# Altium project PCB_Project_Batteries_V2.PrjPCB
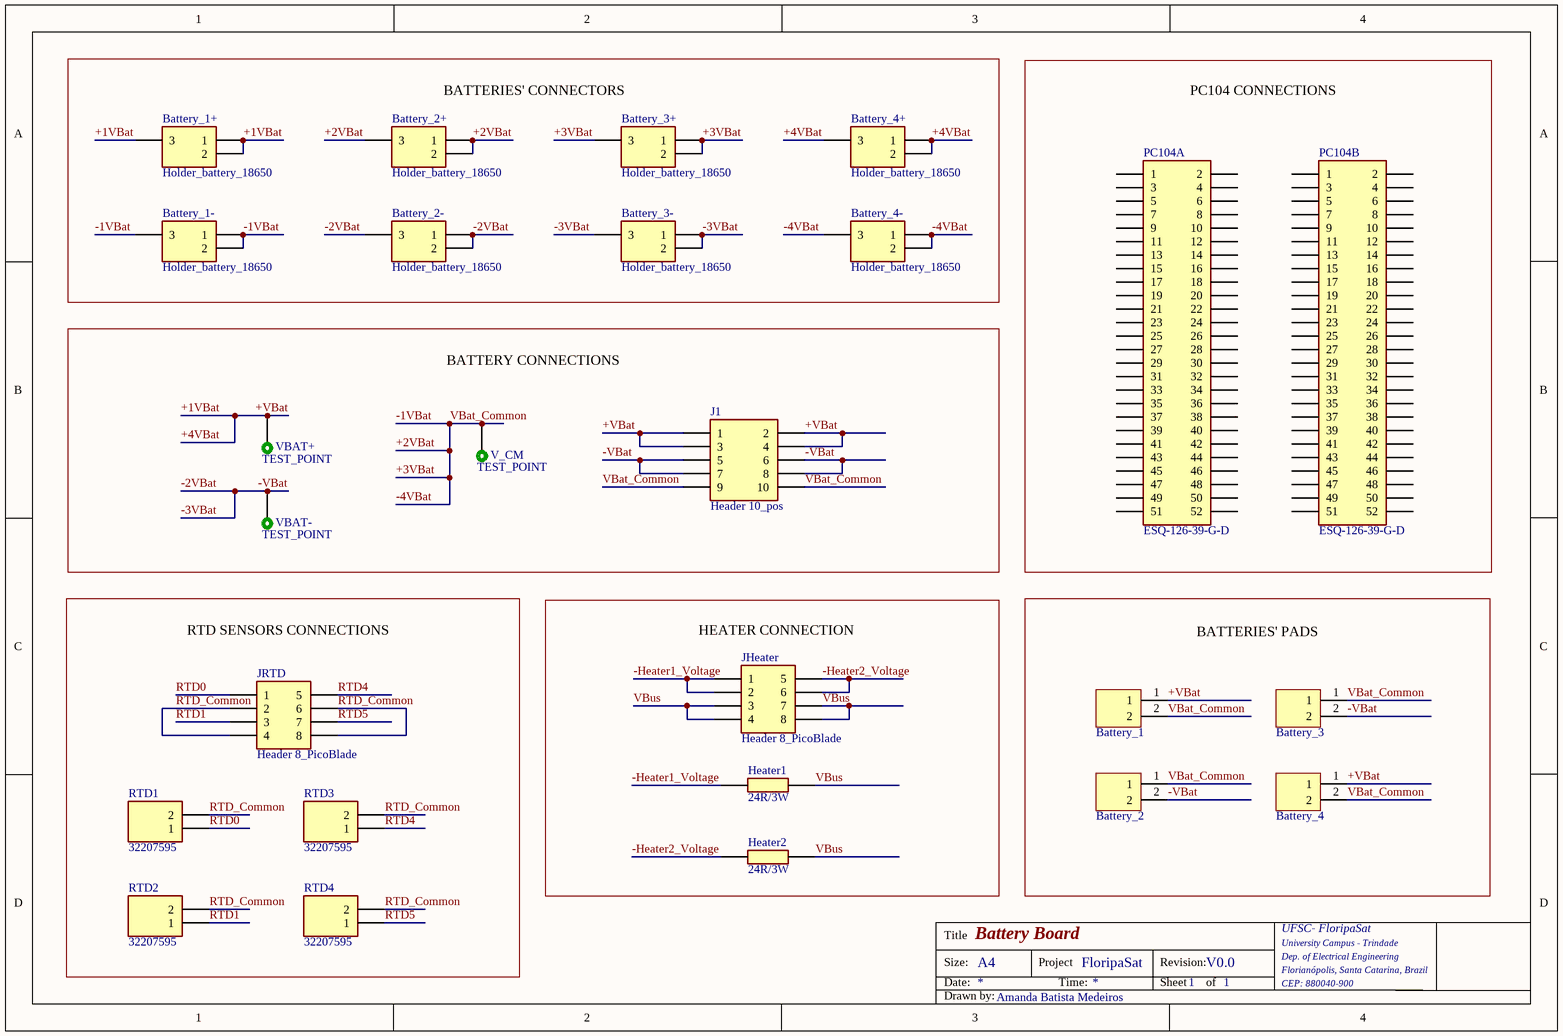
[diagram p0: Sheet_Project_Batteries_V2.SchDoc]
1 sheet, 26 parts. Net scope: global (net labels, ports and power ports of the same name join across sheets).
Board file: PCB_Project_Batteries_V2.PcbDoc

## Sheet Sheet_Project_Batteries_V2.SchDoc: Battery Board
size A4; Author: FloripaSat; CompanyName: UFSC - FloripaSat; DrawnBy: Amanda Batista Medeiros; Organization: UFSC- FloripaSat; Address1: University Campus - Trindade; Address2: Dep. of Electrical Engineering; Address3: Florianópolis, Santa Catarina, Brazil; Address4: CEP: 880040-900; Revision: V0.0; SheetNumber: 1; SheetTotal: 1

### Parts
Battery_1  BATTERY  [BATTERY]  (value not drawn)  (no BOM)
Battery_1+  Holder_battery_18650  [54]
Battery_1-  Holder_battery_18650  [54]
Battery_2  BATTERY  [BATTERY]  (value not drawn)  (no BOM)
Battery_2+  Holder_battery_18650  [54]
Battery_2-  Holder_battery_18650  [54]
Battery_3  BATTERY  [BATTERY]  (value not drawn)  (no BOM)
Battery_3+  Holder_battery_18650  [54]
Battery_3-  Holder_battery_18650  [54]
Battery_4  BATTERY  [BATTERY]  (value not drawn)  (no BOM)
Battery_4+  Holder_battery_18650  [54]
Battery_4-  Holder_battery_18650  [54]
Heater1  24R/3W  [RESAD3322W86L1422D475]
Heater2  24R/3W  [RESAD3322W86L1422D475]
J1  Header 10_pos  [HDRV10W64P254_2X5_1270X502X521P]
JHeater  Header 8_PicoBlade  [53398-0871]
JRTD  Header 8_PicoBlade  [53398-0871]
PC104A  ESQ-126-39-G-D  [ESQ-126-Y-X-D]
PC104B  ESQ-126-39-G-D  [ESQ-126-Y-X-D]
RTD1  32207595  [THRMC3216X70N]
RTD2  32207595  [THRMC3216X70N]
RTD3  32207595  [THRMC3216X70N]
RTD4  32207595  [THRMC3216X70N]
V_CM  TEST_POINT  [Test_Point]
VBAT+  TEST_POINT  [Test_Point]
VBAT-  TEST_POINT  [Test_Point]

### Blocks framed on the sheet
BATTERIES' CONNECTORS: Battery_1+ Battery_1- Battery_2+ Battery_2- Battery_3+ Battery_3- Battery_4+ Battery_4-
PC104 CONNECTIONS: PC104A PC104B
BATTERY CONNECTIONS: J1 V_CM VBAT+ VBAT-
RTD SENSORS CONNECTIONS: JRTD RTD1-RTD4
HEATER CONNECTION: Heater1 Heater2 JHeater
BATTERIES' PADS: Battery_1-Battery_4

### Nets
+1VBat: Battery_1.1 Battery_1+.1 Battery_1+.2 Battery_1+.3 Battery_4.1 Battery_4+.1 Battery_4+.2 Battery_4+.3 J1.1 J1.2 J1.3 J1.4 VBAT+.1  [also labelled +4VBat, +VBat]
+2VBat: Battery_1.2 Battery_1-.1 Battery_1-.2 Battery_1-.3 Battery_2.1 Battery_2+.1 Battery_2+.2 Battery_2+.3 Battery_3.1 Battery_3+.1 Battery_3+.2 Battery_3+.3 Battery_4.2 Battery_4-.1 Battery_4-.2 Battery_4-.3 J1.9 J1.10 V_CM.1  [also labelled +3VBat, -1VBat, -4VBat, VBat_Common]
-2VBat: Battery_2.2 Battery_2-.1 Battery_2-.2 Battery_2-.3 Battery_3.2 Battery_3-.1 Battery_3-.2 Battery_3-.3 J1.5 J1.6 J1.7 J1.8 VBAT-.1  [also labelled -3VBat, -VBat]
-Heater1_Voltage: Heater1.1 JHeater.1 JHeater.2
-Heater2_Voltage: Heater2.1 JHeater.5 JHeater.6
RTD0: JRTD.1 RTD1.1
RTD1: JRTD.3 RTD2.1
RTD4: JRTD.5 RTD3.1
RTD5: JRTD.7 RTD4.1
RTD_Common: JRTD.2 JRTD.4 JRTD.6 JRTD.8 RTD1.2 RTD2.2 RTD3.2 RTD4.2
VBus: Heater1.2 Heater2.2 JHeater.3 JHeater.4 JHeater.7 JHeater.8

Not connected (* = marked no-connect by the designer): PC104A 1 2 3 4 5 6 7 8 9 10 11 12 13 14 15 16 17 18 19 20 21 22 23 24 25 26 27 28 29 30 31 32 33 34 35 36 37 38 39 40 41 42 43 44 45 46 47 48 49 50 51 52; PC104B 1 2 3 4 5 6 7 8 9 10 11 12 13 14 15 16 17 18 19 20 21 22 23 24 25 26 27 28 29 30 31 32 33 34 35 36 37 38 39 40 41 42 43 44 45 46 47 48 49 50 51 52

### Notes on the sheet
- Title
- Size:
- Date:
- A4
- Project
- Time:
- Revision:
- Sheet
- of
- Drawn by:

### Library data of the parts
Battery_1-Battery_4 = BATTERY: Battery Pads
Battery_1+ Battery_1- Battery_2+ Battery_2- Battery_3+ Battery_3- Battery_4+ Battery_4- = 54: Cylindrical Battery Contacts, Clips, Holders & Springs 16-19mm PC BATTERY CLIP; Manufacturer_Name: Keystone Electronics; Allied_Number: 70229904; Datasheet Link: http://www.farnell.com/datasheets/1703960.pdf; Manufacturer_Part_Number: 54; Mouser Part Number: 534-54; Mouser Price/Stock: https://www.mouser.co.uk/ProductDetail/Keystone-Electronics/54?qs=73q%2FgRcW4F3NakoJDesViw%3D%3D; Allied Price/Stock: http://www.alliedelec.com/keystone-electronics-54/70229904/
Heater1 Heater2 = RS02B24R00FE12: Wirewound Resistors - Through Hole 3watts 24ohms 1%; Manufacturer_Name: Vishay; Allied_Number: 71331327; Datasheet Link: https://www.vishay.com/docs/30204/rsns.pdf; Manufacturer_Part_Number: RS02B24R00FE12; Allied Price/Stock: https://www.alliedelec.com/vishaydale-rs02b24r00fe12/71331327/
J1 = TSW-105-05-G-D: Headers & Wire Housings .100" Terminal Strip; Manufacturer_Name: SAMTEC; Datasheet Link: http://suddendocs.samtec.com/catalog_english/tsw_th.pdf; Height: 5.21mm; Manufacturer_Part_Number: TSW-105-05-G-D; Mouser Part Number: 200-TSW10505GD; Mouser Price/Stock: https://www.mouser.com/Search/Refine.aspx?Keyword=200-TSW10505GD; RS Part Number: 1803271; RS Price/Stock: http://uk.rs-online.com/web/p/products/1803271
JHeater JRTD = 53398-0871: Headers & Wire Housings VERTICAL HDR SMT 8P; Manufacturer_Name: Molex; Datasheet Link: https://componentsearchengine.com/Datasheets/1/53398-0871.pdf; Mouser2 Part Number: 538-53398-0871; Mouser2 Price/Stock: https://www.mouser.com/Search/Refine.aspx?Keyword=538-53398-0871; Manufacturer_Part_Number: 53398-0871
PC104A PC104B = ESQ-126-39-G-D: PC / 104 Connectors .100" PC/104 Elevated Socket Strip; Manufacturer_Name: SAMTEC; Datasheet Link: http://suddendocs.samtec.com/catalog_english/esq_th.pdf; Height: 13.84mm; Manufacturer_Part_Number: ESQ-126-39-G-D; Mouser Part Number: 200-ESQ12639GD; Mouser Price/Stock: https://www.mouser.co.uk/ProductDetail/Samtec/ESQ-126-39-G-D?qs=Cqqh%252BS766wm7W672HSOlSA%3D%3D; RS Part Number: 1595654; RS Price/Stock: http://uk.rs-online.com/web/p/products/1595654
RTD1-RTD4 = 32207595: Board Mount Temperature Sensors SMD1206(V) Pt 1000 Class B -50 to +130C; Manufacturer_Name: Heraeus Nexensos; Datasheet Link: https://componentsearchengine.com/Datasheets/1/32207595.pdf; Height: 0.7mm; Manufacturer_Part_Number: 32207595
V_CM VBAT+ VBAT- = TEST_POINT: Test Point - Headers & Wire Housings .100" Terminal Strip